# Altium schematic sheet Sheet1.SchDoc
size A; SheetNumber: 1; SheetTotal: 1
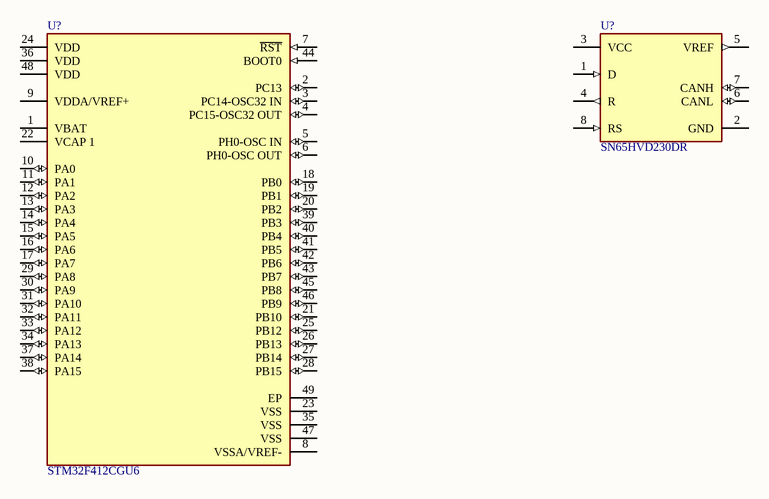
[diagram p0: Sheet1.SchDoc]

## Parts
(Parts that share a designator on the sheet are numbered #1, #2 ... from top to bottom, then left to right.)
U?#1  STM32F412CGU6  [FP-UFQFPN48-A0B9-MFG]
U?#2  SN65HVD230DR  [FP-D0008A-IPC_A]

## Nets

Not connected (* = marked no-connect by the designer): U?#1 1(VBAT) 2(PC13) 3(PC14-OSC32_IN) 4(PC15-OSC32_OUT) 5(PH0-OSC_IN) 6(PH0-OSC_OUT) 7(~{RST}) 8(VSSA/VREF-) 9(VDDA/VREF+) 10(PA0) 11(PA1) 12(PA2) 13(PA3) 14(PA4) 15(PA5) 16(PA6) 17(PA7) 18(PB0) 19(PB1) 20(PB2) 21(PB10) 22(VCAP_1) 23(VSS) 24(VDD) 25(PB12) 26(PB13) 27(PB14) 28(PB15) 29(PA8) 30(PA9) 31(PA10) 32(PA11) 33(PA12) 34(PA13) 35(VSS) 36(VDD) 37(PA14) 38(PA15) 39(PB3) 40(PB4) 41(PB5) 42(PB6) 43(PB7) 44(BOOT0) 45(PB8) 46(PB9) 47(VSS) 48(VDD) 49(EP); U?#2 1(D) 2(GND) 3(VCC) 4(R) 5(VREF) 6(CANL) 7(CANH) 8(RS)

## Library data of the parts
U?#1 = CMP-12105-000086-1: IC MCU 32BIT 1MB FLASH 48UFQFPN; Frequency: 100MHz; Peripherals: Brown-out Detect/Reset; Number of I/Os: 36; Interface: I2C; Core Architecture: ARM; Oscillator Type: Internal; Memory Type: FLASH; Memory Size: 1MB; Min Operating Temperature: -40°C; Max Operating Temperature: 85°C
U?#2 = CMP-0315-00015-3: IC TRANSCEIVER HALF 1/1 8SOIC; Number of Transceivers: 1; Operating Supply Voltage: 3.3V; Number of I/Os: 2; Max Supply Current: 17mA; Max Supply Voltage: 3.6V; Min Supply Voltage: 3V; Data Rate: 1Mbps; Min Operating Temperature: -40°C; Packaging: Tape and Reel; Lead Free: Lead Free; Number of Transmit Buffers: 1; Max Operating Temperature: 85°C; Number of Receive Buffers: 1; Number of Pins: 8; Package Quantity: 1; Radiation Hardening: No; Case/Package: D; REACH SVHC: No SVHC; Weight: 0.002561oz; Termination: SMD/SMT; Contact Plating: Gold; Nominal Supply Current: 17mA; Number of Receivers: 1; Number of Drivers: 1